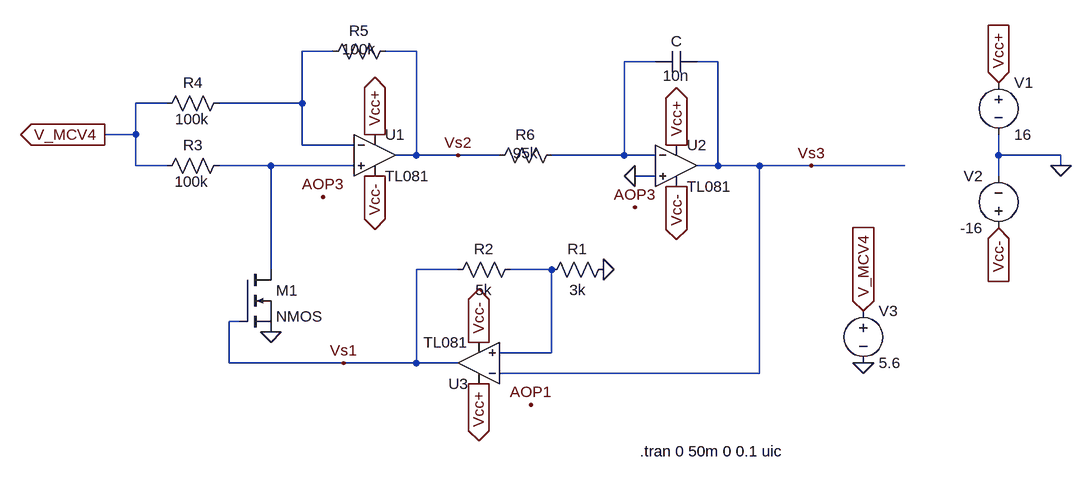
[diagram p0: schematic simu_complete.asc]
simu_complete.asc, the LTspice schematic file:
Version 4
SHEET 1 1608 680
WIRE 416 -32 368 -32
WIRE 544 -32 496 -32
WIRE 912 -16 864 -16
WIRE 1008 -16 976 -16
WIRE 160 48 112 48
WIRE 368 48 368 -32
WIRE 368 48 240 48
WIRE 112 96 112 48
WIRE 112 96 64 96
WIRE 368 112 368 48
WIRE 448 112 368 112
WIRE 544 128 544 -32
WIRE 544 128 512 128
WIRE 608 128 544 128
WIRE 672 128 608 128
WIRE 864 128 864 -16
WIRE 864 128 752 128
WIRE 912 128 864 128
WIRE 1440 128 1440 96
WIRE 1536 128 1440 128
WIRE 112 144 112 96
WIRE 160 144 112 144
WIRE 320 144 240 144
WIRE 448 144 320 144
WIRE 1008 144 1008 -16
WIRE 1008 144 976 144
WIRE 1072 144 1008 144
WIRE 1152 144 1072 144
WIRE 1296 144 1152 144
WIRE 1536 144 1536 128
WIRE 912 160 880 160
WIRE 1440 160 1440 128
WIRE 320 304 320 144
WIRE 608 304 544 304
WIRE 752 304 688 304
WIRE 272 384 256 384
WIRE 752 432 752 304
WIRE 752 432 672 432
WIRE 256 448 256 384
WIRE 432 448 256 448
WIRE 544 448 544 304
WIRE 544 448 432 448
WIRE 608 448 544 448
WIRE 1072 464 1072 144
WIRE 1072 464 672 464
FLAG 480 96 Vcc+
IOPIN 480 96 Out
FLAG 480 160 Vcc-
IOPIN 480 160 Out
FLAG 1536 144 0
FLAG 1440 16 Vcc+
IOPIN 1440 16 In
FLAG 1440 240 Vcc-
IOPIN 1440 240 In
FLAG 64 96 V_MCV4
IOPIN 64 96 Out
FLAG 320 400 0
FLAG 944 112 Vcc+
IOPIN 944 112 Out
FLAG 944 176 Vcc-
IOPIN 944 176 Out
FLAG 880 160 0
FLAG 1152 144 Vs3
FLAG 640 480 Vcc+
IOPIN 640 480 Out
FLAG 640 416 Vcc-
IOPIN 640 416 Out
FLAG 832 304 0
FLAG 720 512 AOP1
FLAG 400 192 AOP3
FLAG 880 208 AOP3
FLAG 432 448 Vs1
FLAG 608 128 Vs2
FLAG 1232 368 V_MCV4
IOPIN 1232 368 In
FLAG 1232 448 0
SYMBOL res 256 32 R90
WINDOW 0 0 56 VBottom 2
WINDOW 3 56 57 VBottom 2
SYMATTR InstName R4
SYMATTR Value 100k
SYMBOL res 256 128 R90
WINDOW 0 0 56 VBottom 2
WINDOW 3 56 58 VBottom 2
SYMATTR InstName R3
SYMATTR Value 100k
SYMBOL res 512 -48 R90
WINDOW 0 0 56 VBottom 2
WINDOW 3 28 56 VBottom 2
SYMATTR InstName R5
SYMATTR Value 100k
SYMBOL voltage 1440 0 R0
WINDOW 123 0 0 Left 0
WINDOW 39 0 0 Left 0
SYMATTR InstName V1
SYMATTR Value 16
SYMBOL voltage 1440 256 R180
WINDOW 0 24 96 Left 2
WINDOW 3 24 16 Left 2
WINDOW 123 0 0 Left 0
WINDOW 39 0 0 Left 0
SYMATTR InstName V2
SYMATTR Value -16
SYMBOL nmos 272 304 R0
SYMATTR InstName M1
SYMBOL res 768 112 R90
WINDOW 0 0 56 VBottom 2
WINDOW 3 28 56 VBottom 2
SYMATTR InstName R6
SYMATTR Value 95k
SYMBOL cap 912 0 R270
WINDOW 0 32 32 VTop 2
WINDOW 3 -21 32 VTop 2
SYMATTR InstName C
SYMATTR Value 10n
SYMBOL OpAmps\\TL081 944 80 R0
SYMATTR InstName U2
SYMBOL OpAmps\\TL081 640 512 R180
SYMATTR InstName U3
SYMBOL res 704 288 R90
WINDOW 0 0 56 VBottom 2
WINDOW 3 32 56 VTop 2
SYMATTR InstName R2
SYMATTR Value 5k
SYMBOL res 736 320 R270
WINDOW 0 32 56 VTop 2
WINDOW 3 0 56 VBottom 2
SYMATTR InstName R1
SYMATTR Value 3k
SYMBOL OpAmps\\TL081 480 64 R0
SYMATTR InstName U1
SYMBOL voltage 1232 352 R0
WINDOW 123 0 0 Left 0
WINDOW 39 0 0 Left 0
SYMATTR InstName V3
SYMATTR Value 5.6
TEXT 888 584 Left 2 !.tran 0 50m 0 0.1 uic

The netlist it stands for:
* simu_complete.asc
R4 N001 V_MCV4 100k
R3 N003 V_MCV4 100k
R5 Vs2 N001 100k
V1 Vcc+ 0 16
V2 Vcc- 0 -16
M1 N003 Vs1 0 0 NMOS
R6 N002 Vs2 95k
C N002 Vs3 10n
XU2 0 N002 Vcc+ Vcc- Vs3 TL081  ; pins In+ In- V+ V- OUT
XU3 N004 Vs3 Vcc+ Vcc- Vs1 TL081  ; pins In+ In- V+ V- OUT
R2 N004 Vs1 5k
R1 N004 0 3k
XU1 N003 N001 Vcc+ Vcc- Vs2 TL081  ; pins In+ In- V+ V- OUT
V3 V_MCV4 0 5.6
.model NMOS NMOS
.model PMOS PMOS
.lib standard.mos
.tran 0 50m 0 0.1 uic
.backanno
.end

* Results of the author's LTspice run, read from the files saved beside the schematic
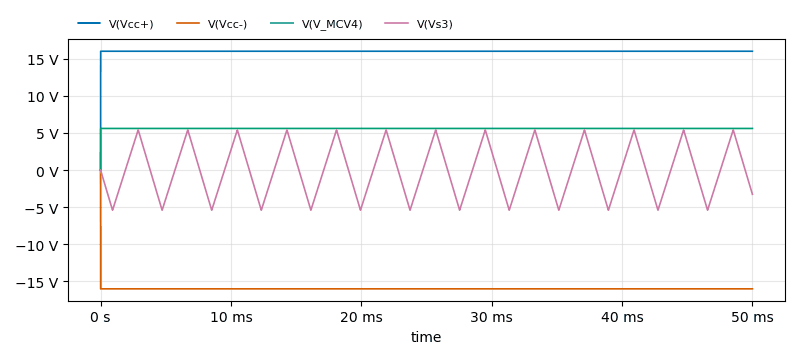
[diagram p1: Transient Analysis of simu_complete.asc, plotted from the saved traces]
* Transient Analysis, 1 run:
*   V(Vcc+): min 0 V, max 16 V, average 16 V, rms 16 V, last 16 V
*   V(Vcc-): min -16 V, max 0 V, average -16 V, rms 16 V, last -16 V
*   V(V_MCV4): min 0 V, max 5.6 V, average 5.6 V, rms 5.6 V, last 5.6 V
*   V(Vs3): min -5.411 V, max 5.408 V, average -19.95 mV, rms 4.829 V, last -3.266 V